# EAGLE design adapter (EAGLE 7.2.0)
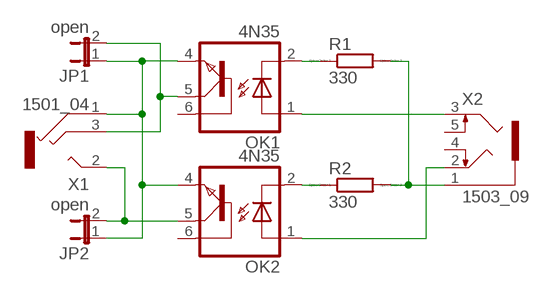
[diagram p0: schematic, sheet 1]

## Parts
JP1  open  JP1E  [JP1]
JP2  open  JP1E  [JP1]
OK1  4N35  [DIL06]
OK2  4N35  [DIL06]
R1  330  R0207/10  [0207/10]
R2  330  R0207/10  [0207/10]
X1  1501_04  [1501_05]
X2  1503_09  [1503_09]

## Nets
N$1: JP1.1 JP2.1 OK1.4(EMI) OK2.4(EMI) X1.1
N$2: OK1.2(C) R1.1
N$3: OK2.2(C) R2.1
N$4: R1.2 R2.2 X2.1
N$5: JP1.2 OK1.5(COL) X1.3
N$6: JP2.2 OK2.5(COL) X1.2
N$7: OK2.1(A) X2.2
N$8: OK1.1(A) X2.3
Unconnected: OK1.6(BAS) OK2.6(BAS) X2.4 X2.5

## Library data of the parts
JP1 JP2 = jumper:JP1E: JUMPER
OK1 OK2 = optocoupler:4N35: MOTOROLA OPTO COUPLER; MF: VISHAY; MPN: 4N35; OC_FARNELL: 1328375; OC_NEWARK: 72K9946
R1 R2 = eagle-ltspice:R: RESISTOR, European symbol; OC_FARNELL: unknown; SPICEMODEL: NONE; SPICEPREFIX: R
X1 = con-lumberg:1501_0*: Jack connectors according to JISC 6560, 2.5 mm Klinkensteckverbinder nach JISC 6560, 2,5 mm Source: http://www.lumberg.com/Produkte/PDFs/1501_05.pdfedit 1501_03 http://www.lumberg.com/Produkte/PDFs/1501_06.pdf; OC_FARNELL: 1216977; OC_NEWARK: unknown
X2 = con-lumberg:1503_09: Jack connectors according to JISC 6560, 3.5 mm Klinkeneinbaukupplung nach JISC 6560, 3,5 mm, 3-polig/ stereo, abgewinkelte Ausführung, mit 2 Öffnern und Lötaugen, für Leiterplatten Rückseitenmontage Source: http://www.lumberg.com/Produkte/PDFs/1503_09.pdf; OC_FARNELL: 1243244; OC_NEWARK: unknown

## Board
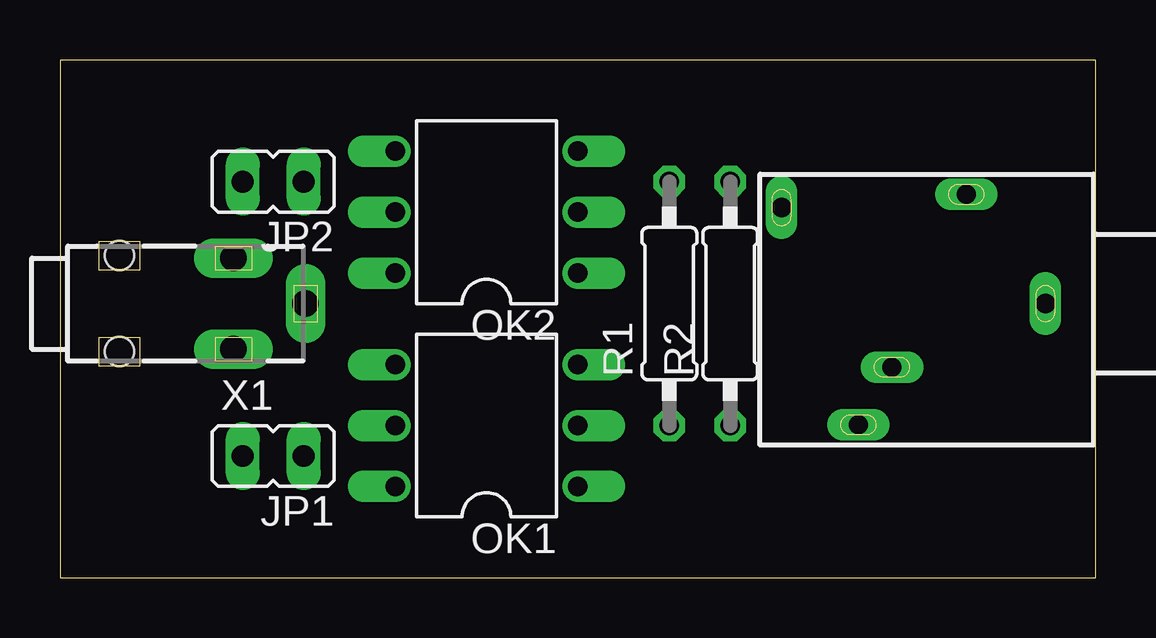
[diagram p1: board, top side]
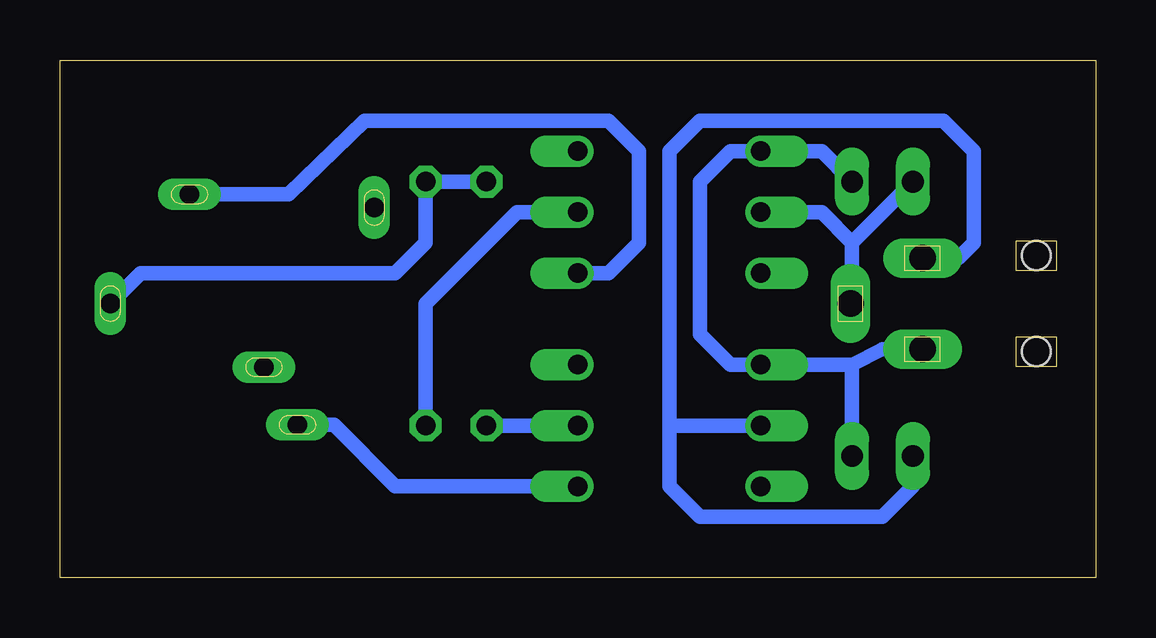
[diagram p2: board, bottom side, seen from below]

Size 43.18 x 21.58 mm. Coordinates in mm from the lower left corner, seen from the top.
Outline: 0,0 43.18,0 43.18,21.58 0,21.58 0,0
Copper layers (1*16): Top 0.035mm / dielectric 1.5mm / Bottom 0.035mm
Design rules "default *": minimum track width 10mil, minimum drill 24mil, track to track 10mil, track to pad 10mil, pad to pad 10mil, via to via 10mil, smd to smd 8mil, copper to edge 40mil, drill to drill 8mil, minimum pad ring 10mil, minimum via ring 8mil, stop-mask expansion 4mil, vias tented up to drill 0mil, thermal gap 10mil

### Footprints (pad centres in the part's own frame; a part is rotated, then mirrored left to right if it is on the bottom)
JP1 = drill 0.914 long: 1 0,-1.27; 2 0,1.27
DIL06 = drill 0.813 offset: 1 -2.54,-3.81; 2 0,-3.81; 3 2.54,-3.81; 4 2.54,3.81; 5 0,3.81; 6 -2.54,3.81
0207/10 = drill 0.813 octagon: 1 -5.08,0; 2 5.08,0
1501_05 = drill 1.1 pad 1.4 long: 1 -1.9,-8.5; 2 0,-11.5; 3 1.9,-8.5 | hole 1.2: -2,-3.75; 2,-3.75
1503_09 = drill 0.8 pad 1.2 long: 1 0,-2.1; 2 -4.55,-5.4; 3 5.05,-9.9; 4 -4,-13.1; 5 2.65,-8.5

### Placement (x,y rotation side)
JP1  8.89,5.08 90 top
JP2  8.89,16.51 90 top
OK1  17.78,6.35 90 top
OK2  17.78,15.24 90 top
R1  25.4,11.43 90 top
R2  27.94,11.43 90 top
X1  -1.27,11.43 90 top
X2  43.18,11.43 270 top

### Tracks (layer width: path | path; a pad name or v marks a point on that pad's centre or on a via)
N$1
  Bottom 0.61: X1.1 8.89,9.53 10.16,8.89 | JP1.1 10.16,8.89 | 10.16,8.89 OK1.4 15.24,8.89 16.51,10.16 16.51,16.51 15.24,17.78 OK2.4 11.43,17.78 JP2.1
N$2
  Bottom 0.61: OK1.2 R1.1
N$3
  Bottom 0.61: OK2.2 24.13,15.24 27.94,11.43 R2.1
N$4
  Bottom 0.61: R1.2 R2.2 27.94,13.97 29.21,12.7 39.81,12.7 X2.1
N$5
  Bottom 0.61: X1.3 5.71,13.34 5.08,13.97 5.08,17.78 6.35,19.05 16.51,19.05 17.78,17.78 17.78,6.35 | 17.78,6.35 OK1.5 | JP1.2 7.62,3.81 8.89,2.54 16.51,2.54 17.78,3.81 17.78,6.35
N$6
  Bottom 0.61: OK2.5 11.43,15.24 10.16,13.97 | JP2.2 10.16,13.97 | 10.16,13.97 10.16,11.43 X1.2
N$7
  Bottom 0.61: OK2.1 20.32,12.7 19.05,13.97 19.05,17.78 20.32,19.05 30.48,19.05 33.65,15.98 X2.2
N$8
  Bottom 0.61: X2.3 31.75,6.38 29.21,3.81 OK1.1